# EAGLE schematic fiddle (EAGLE 7.3.0)
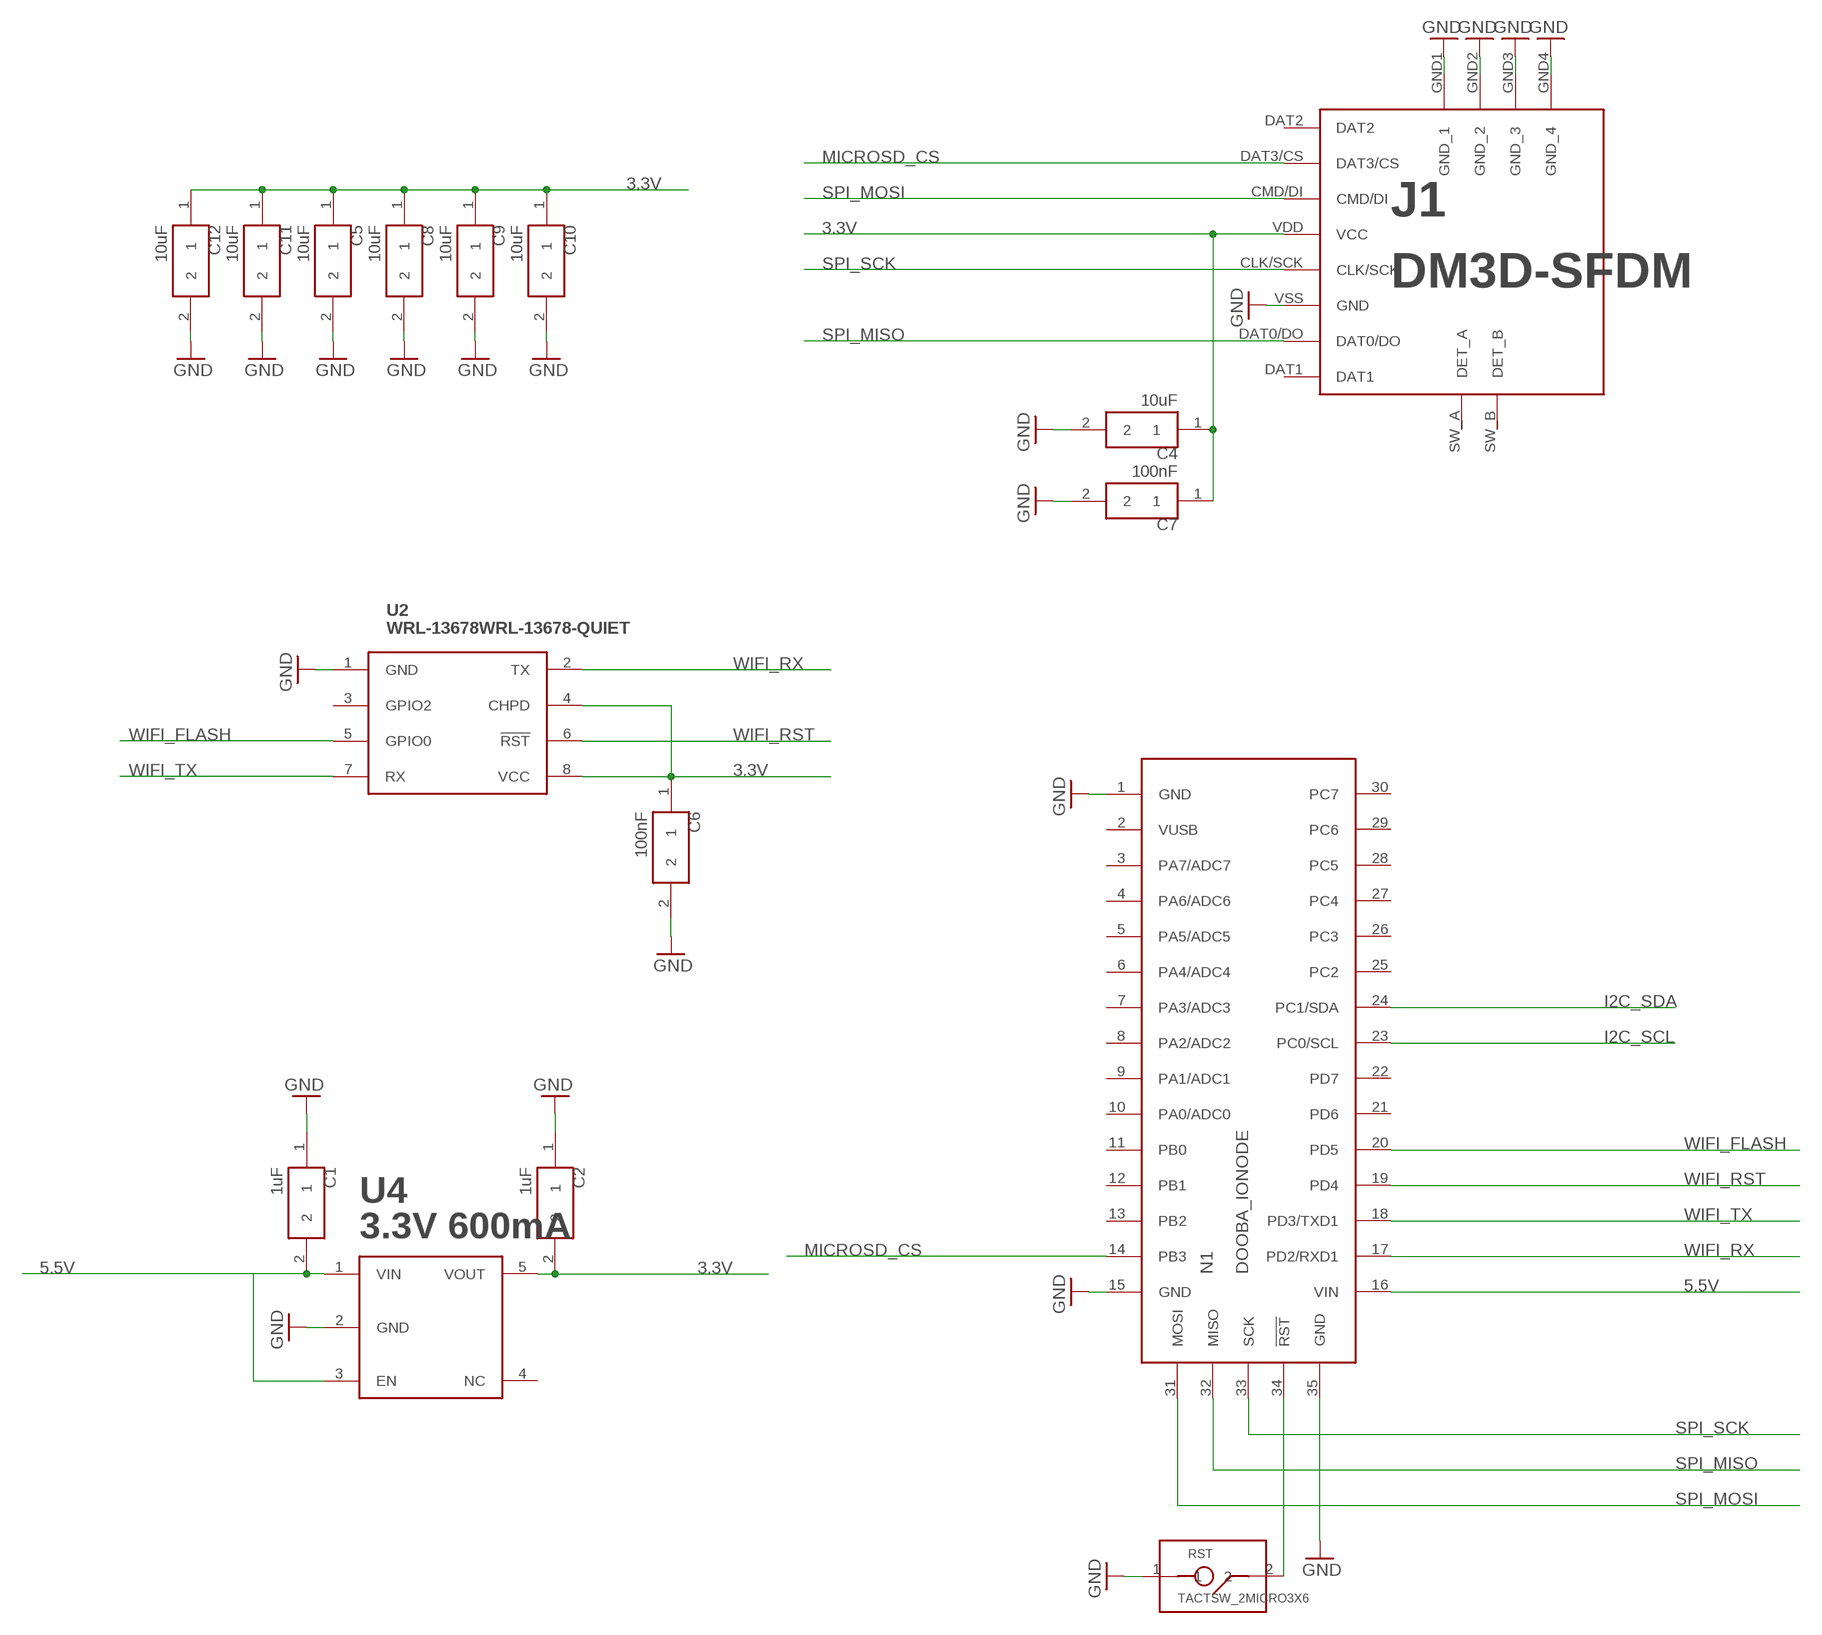
[diagram p0: schematic, sheet 1, part 1 of 2]
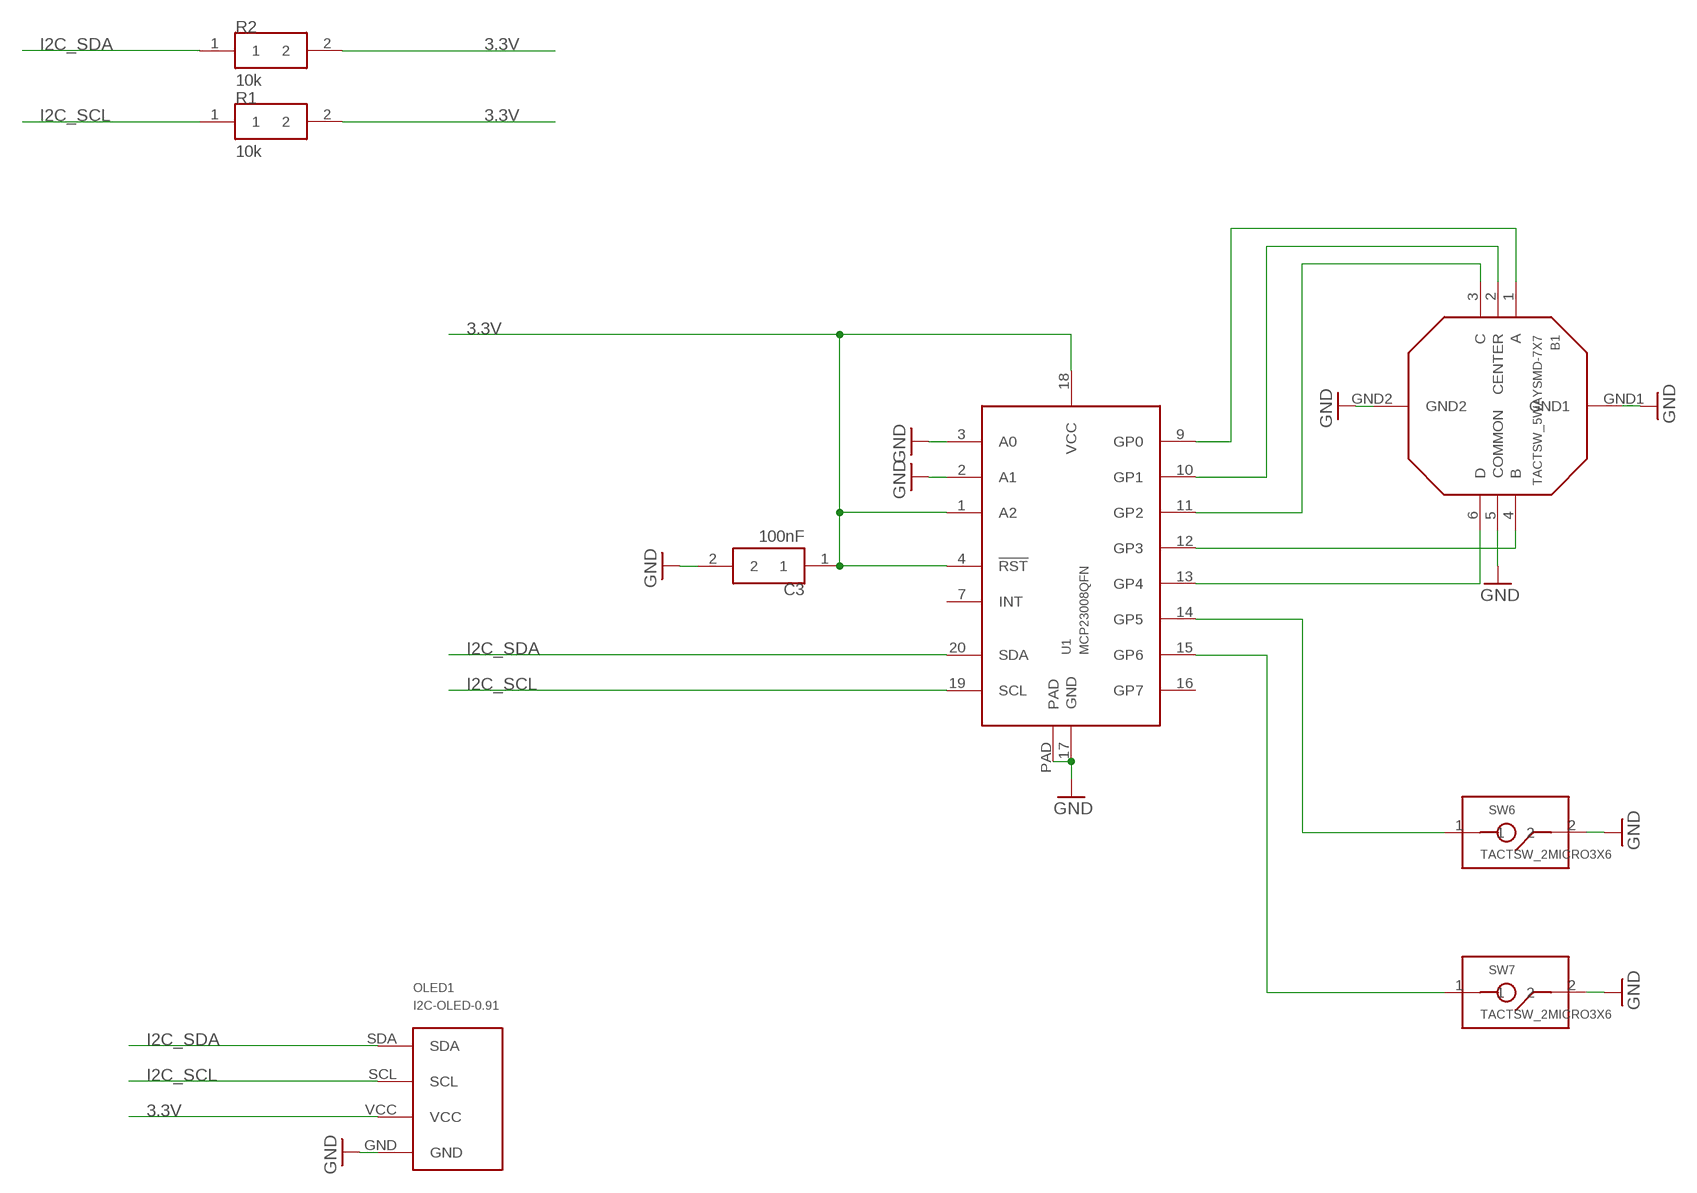
[diagram p1: schematic, sheet 1, part 2 of 2]

## Parts
B1  TACTSW_5WAYSMD-7X7  [TACTSW-5WAY-7X7]
C1  1uF  CAP0805  [0805]
C2  1uF  CAP0805  [0805]
C3  100nF  CAP0805  [0805]
C4  10uF  CAP0805  [0805]
C5  10uF  CAP0805  [0805]
C6  100nF  CAP0805  [0805]
C7  100nF  CAP0805  [0805]
C8  10uF  CAP0805  [0805]
C9  10uF  CAP0805  [0805]
C10  10uF  CAP0805  [0805]
C11  10uF  CAP0805  [0805]
C12  10uF  CAP0805  [0805]
J1  DM3D-SFDM  [DM3D-SF]
N1  DOOBA_IONODE  [DOOBA_IONODE]
OLED1  I2C-OLED-0.91  [I2C-OLED-0.91]
R1  10k  RES0805  [0805]
R2  10k  RES0805  [0805]
RST  TACTSW_2MICRO3X6  [TACTSW_MICRO3X6]
SW6  TACTSW_2MICRO3X6  [TACTSW_MICRO3X6]
SW7  TACTSW_2MICRO3X6  [TACTSW_MICRO3X6]
U1  MCP23008QFN  [20-VQFN]
U2  WRL-13678WRL-13678-QUIET  [WRL-13678-QUIET]
U4  3.3V 600mA  LP3985SOT23-5  [SOT23-5]

## Nets
3.3V: C2.2 C3.1 C4.1 C5.1 C6.1 C7.1 C8.1 C9.1 C10.1 C11.1 C12.1 J1.VDD(VCC) OLED1.VCC R1.2 R2.2 U1.1(A2) U1.4(!RST) U1.18(VCC) U2.4(CHPD) U2.8(VCC) U4.5(VOUT)
5.5V: C1.2 N1.16(VIN) U4.1(VIN) U4.3(EN)
GND: B1.5(COMMON) B1.GND1 B1.GND2 C1.1 C2.1 C3.2 C4.2 C5.2 C6.2 C7.2 C8.2 C9.2 C10.2 C11.2 C12.2 J1.GND1(GND_1) J1.GND2(GND_2) J1.GND3(GND_3) J1.GND4(GND_4) J1.VSS(GND) N1.1(GND) N1.15(GND) N1.35(GND) OLED1.GND RST.1 SW6.2 SW7.2 U1.2(A1) U1.3(A0) U1.17(GND) U1.PAD U2.1(GND) U4.2(GND)
I2C_SCL: N1.23(PC0/SCL) OLED1.SCL R1.1 U1.19(SCL)
I2C_SDA: N1.24(PC1/SDA) OLED1.SDA R2.1 U1.20(SDA)
MICROSD_CS: J1.DAT3/CS N1.14(PB3)
N$1: B1.1(A) U1.9(GP0)
N$2: B1.2(CENTER) U1.10(GP1)
N$3: B1.3(C) U1.11(GP2)
N$4: B1.6(D) U1.13(GP4)
N$5: B1.4(B) U1.12(GP3)
N$6: SW6.1 U1.14(GP5)
N$7: SW7.1 U1.15(GP6)
N$8: N1.34(!RST) RST.2
SPI_MISO: J1.DAT0/DO N1.32(MISO)
SPI_MOSI: J1.CMD/DI N1.31(MOSI)
SPI_SCK: J1.CLK/SCK N1.33(SCK)
WIFI_FLASH: N1.20(PD5) U2.5(GPIO0)
WIFI_RST: N1.19(PD4) U2.6(!RST)
WIFI_RX: N1.17(PD2/RXD1) U2.2(TX)
WIFI_TX: N1.18(PD3/TXD1) U2.7(RX)
Unconnected: J1.DAT1 J1.DAT2 J1.SW_A(DET_A) J1.SW_B(DET_B) N1.2(VUSB) N1.3(PA7/ADC7) N1.4(PA6/ADC6) N1.5(PA5/ADC5) N1.6(PA4/ADC4) N1.7(PA3/ADC3) N1.8(PA2/ADC2) N1.9(PA1/ADC1) N1.10(PA0/ADC0) N1.11(PB0) N1.12(PB1) N1.13(PB2) N1.21(PD6) N1.22(PD7) N1.25(PC2) N1.26(PC3) N1.27(PC4) N1.28(PC5) N1.29(PC6) N1.30(PC7) U1.7(INT) U1.16(GP7) U2.3(GPIO2) U4.4(NC)

## Library data of the parts
B1 = dooba:TACTSW_5WAY
C1-C12 = dooba:CAP
J1 = dooba:DM3D-SF
N1 = dooba:DOOBA_IONODE
OLED1 = dooba:I2C-OLED-0.91
R1 R2 = dooba:RES
RST SW6 SW7 = dooba:TACTSW_2
U1 = dooba:MCP23008
U2 = dooba:WRL-13678
U4 = dooba:LP3985